# EasyEDA schematic Ethernet_Besturing.json
TITLE: GPS Component; REV: 1.0; Date: 2022-01-31; Sheet: 1/1; Company: Aquabots
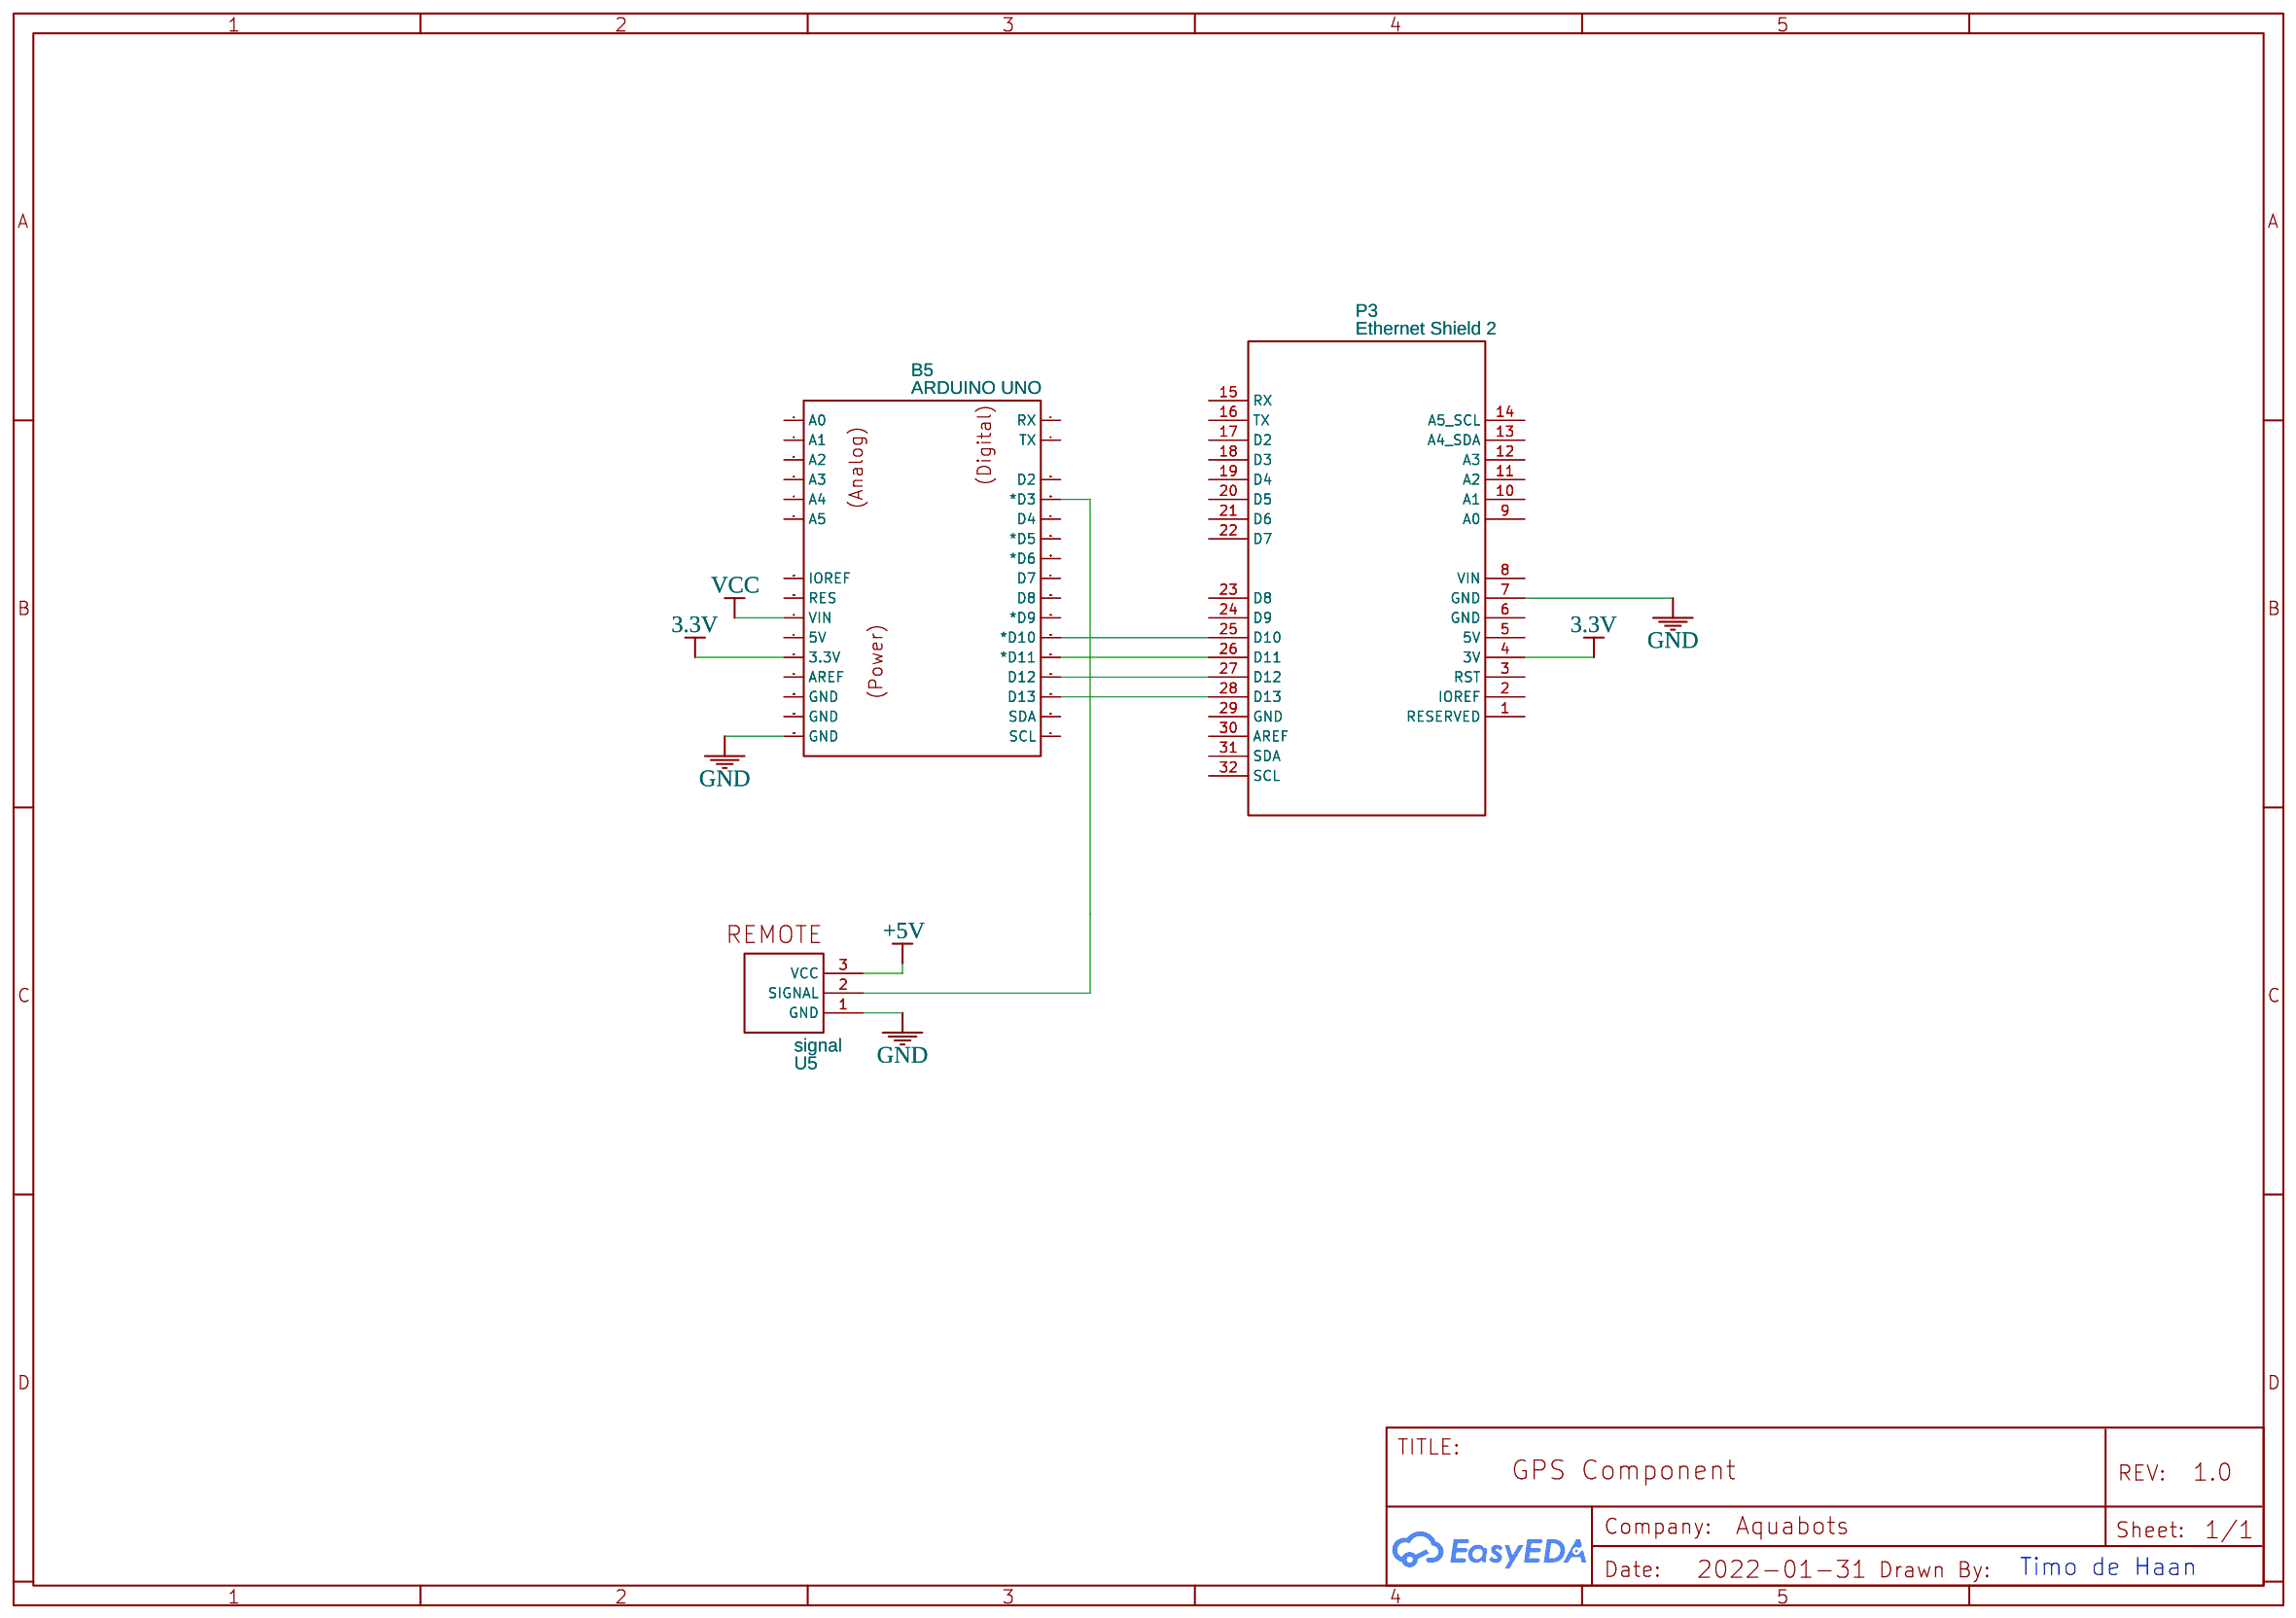
[diagram p0: schematic sheet]

## Parts
B5  ARDUINO UNO  [PKG-ARDUINO-UNO-R3-SHIELD]
P3  Ethernet Shield 2  [ETHERNET SHIELD 2]
U5  signal  [SIGNAL]

## Library data of the parts
B5 = ARDUINO UNO R3 SHIELD: Manufacturer: ?; Manufacturer Part: ?; Link: ?; Contributor: Prof. Ing. F. Scordino
P3 = Ethernet Shield 2: sourceId: 1T5FDZYC8; Contributor: Montre Med
U5 = signal: Contributor: lokander2

## Nets
3.3V: B5.3.3V P3.4(3V)
+5V: U5.3(VCC)
GND: B5.GND@0(GND) P3.7(GND) U5.1(GND)
VCC: B5.VIN
Net-(B5-D3): B5.D3(*D3) U5.2(SIGNAL)
Net-(B5-D10): B5.D10(*D10) P3.25(D10)
Net-(B5-D11): B5.D11(*D11) P3.26(D11)
Net-(B5-D12): B5.D12 P3.27(D12)
Net-(B5-D13): B5.D13 P3.28(D13)

Not connected (* = marked no-connect by the designer): B5 5V A0 A1 A2 A3 A4 A5 AREF D2 D4 D5(*D5) D6(*D6) D7 D8 D9(*D9) GND@1(GND) GND@2(GND) IOREF RES RX SCL SDA TX; P3 1(RESERVED) 2(IOREF) 3(RST) 5(5V) 6(GND) 8(VIN) 9(A0) 10(A1) 11(A2) 12(A3) 13(A4 SDA) 14(A5 SCL) 15(RX) 16(TX) 17(D2) 18(D3) 19(D4) 20(D5) 21(D6) 22(D7) 23(D8) 24(D9) 29(GND) 30(AREF) 31(SDA) 32(SCL)

## Notes on the sheet
- Timo de Haan
